# EAGLE design board_v1 (EAGLE 9.4.0)
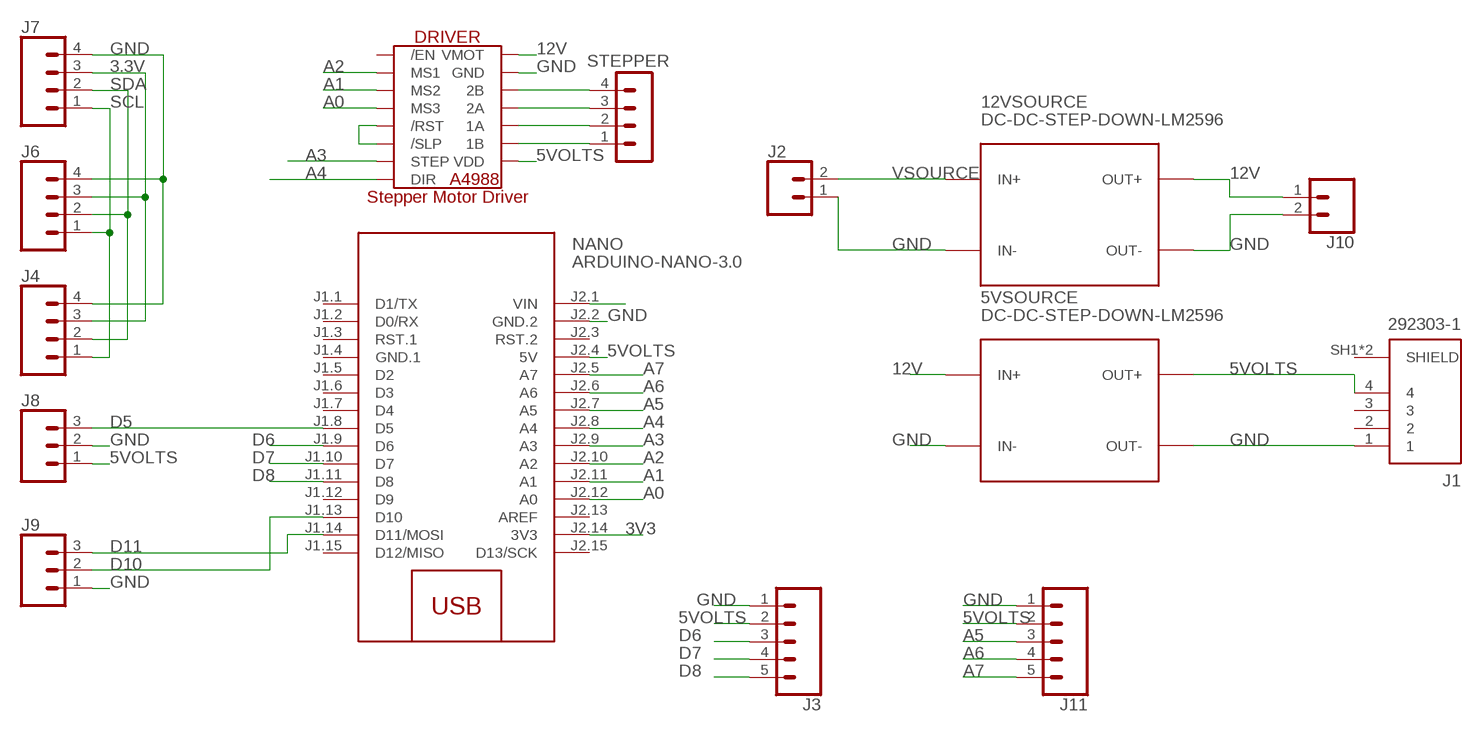
[diagram p0: schematic, sheet 1]

## Parts
5VSOURCE  DC-DC-STEP-DOWN-LM2596  [DC-DC-STEP-DOWN-LM2596]
12VSOURCE  DC-DC-STEP-DOWN-LM2596  [DC-DC-STEP-DOWN-LM2596]
DRIVER  A4988_STEP  [A4988_STEP]
J1  292303-1  [292303-1]
J2  CONN_025MM  [SCREWTERMINAL-5MM-2]
J3  CONN_05  [1X05]
J4  CONN_04POLAR  [MOLEX-1X4]
J6  CONN_04POLAR  [MOLEX-1X4]
J7  CONN_04POLAR  [MOLEX-1X4]
J8  CONN_03POLAR  [MOLEX-1X3]
J9  CONN_03POLAR  [MOLEX-1X3]
J10  CONN_025MM  [SCREWTERMINAL-5MM-2]
J11  CONN_05  [1X05]
NANO  ARDUINO-NANO-3.0  [ARDUINO-NANO-3.0]
STEPPER  MA04-1  [MA04-1]

## Nets
3.3V: J4.3 J6.3 J7.3
3V3: NANO.J2.14(3V3)
5VOLTS: 5VSOURCE.OUT+ DRIVER.VDD J1.4 J3.2 J8.1 J11.2 NANO.J2.4(5V)
12V: 5VSOURCE.IN+ 12VSOURCE.OUT+ DRIVER.VMOT J10.1
A0: DRIVER.MS3 NANO.J2.12(A0)
A1: DRIVER.MS2 NANO.J2.11(A1)
A2: DRIVER.MS1 NANO.J2.10(A2)
A3: DRIVER.STEP NANO.J2.9(A3)
A4: DRIVER.DIR NANO.J2.8(A4)
A5: J11.3 NANO.J2.7(A5)
A6: J11.4 NANO.J2.6(A6)
A7: J11.5 NANO.J2.5(A7)
D5: J8.3 NANO.J1.8(D5)
D6: J3.3 NANO.J1.9(D6)
D7: J3.4 NANO.J1.10(D7)
D8: J3.5 NANO.J1.11(D8)
D10: J9.2 NANO.J1.13(D10)
D11: J9.3 NANO.J1.14(D11/MOSI)
GND: 5VSOURCE.IN- 5VSOURCE.OUT- 12VSOURCE.IN- 12VSOURCE.OUT- DRIVER.GND DRIVER.GND2(GND) J1.1 J2.1 J3.1 J4.4 J6.4 J7.4 J8.2 J9.1 J10.2 J11.1 NANO.J2.2(GND.2)
N$1: NANO.J2.1(VIN)
N$2: DRIVER.2B STEPPER.4
N$6: DRIVER.2A STEPPER.3
N$7: DRIVER.1A STEPPER.2
N$8: DRIVER.1B STEPPER.1
N$10: DRIVER./RST DRIVER./SLP
SCL: J4.1 J6.1 J7.1
SDA: J4.2 J6.2 J7.2
VSOURCE: 12VSOURCE.IN+ J2.2
Unconnected: DRIVER./EN J1.2 J1.3 NANO.J1.1(D1/TX) NANO.J1.2(D0/RX) NANO.J1.3(RST.1) NANO.J1.5(D2) NANO.J1.6(D3) NANO.J1.7(D4) NANO.J1.12(D9) NANO.J1.15(D12/MISO) NANO.J2.3(RST.2) NANO.J2.13(AREF) NANO.J2.15(D13/SCK)

## Power pins joined to a net without a drawn wire
GND.1: NANO.J1.4(GND.1)
SHIELD: J1.SH1(SHIELD) J1.SH2(SHIELD)

## Library data of the parts
5VSOURCE 12VSOURCE = diy-modules:DC-DC-STEP-DOWN-LM2596: DC/DC Step-Down Regulator based on LM2596-ADJ chip LM2596 datasheet available here: http://www.ti.com/lit/ds/symlink/lm2596.pdf Click here to find device on ebay.com <http://www.ebay.com/sch/lm2596+power+regulator>
DRIVER = IC:A4988_STEP
J1 = USB connector:292303-1: CONN RCPT USB2.0 TYPEA 4POS R/A Manufacturer's datasheet <https://www.te.com/commerce/DocumentDelivery/DDEController?Action=srchrtrv&DocNm=292303&DocType=Customer+Drawing&DocLang=English>; CREATED_BY: PCBLayout.com; DIGIKEY_PARTNO: A31726-ND; MANUFACTURER: TE Connectivity AMP Connectors; MPN: 292303-1
J2 J10 = SparkFun-Connectors:CONN_02: Multi connection point. Often used as Generic Header-pin footprint for 0.1 inch spaced/style header connections On any of the 0.1 inch spaced packages, you can populate with these: Break Away Headers - Straight <https://www.sparkfun.com/products/116> (PRT-00116) Break Away Male Headers - Right Angle <https://www.sparkfun.com/products/553> (PRT-00553) Female Headers <https://www.sparkfun.com/products/115> (PRT-00115) Break Away Headers - Machine Pin <https://www.sparkfun.com/products/117> (PRT-00117) Break Away Female Headers - Swiss Machine Pin <https://www.sparkfun.com/products/743> (PRT-00743) For SCREWTERMINALS and SPRING TERMINALS visit here: Screw Terimnals on SparkFun.com <https://www.sparkfun.com/search/results?term=Screw+Terminals> (5mm/3.5mm/2.54mm spacing) This device is also useful as a general connection point to wire up your design to another part of your project. Our various solder wires solder well into these plated through hole pads. Hook-Up Wire - Assortment (Stranded, 22 AWG) <https://www.sparkfun.com/products/11375> (PRT-11375) Hook-Up Wire - Assortment (Solid Core, 22 AWG) <https://www.sparkfun.com/products/11367> (PRT-11367) View the entire wire category on our website here <https://www.sparkfun.com/categories/141> Special notes: Molex polarized connector foot print use with: PRT-08233 with associated crimp pins and housings. 2.54_SCREWTERM for use with PRT-10571. 3.5mm Screw Terminal footprints for PRT-08084 5mm Screw Terminal footprints for use with PRT-08432; SF_SKU: PRT-08432
J3 J11 = SparkFun-Connectors:CONN_05: Multi connection point. Often used as Generic Header-pin footprint for 0.1 inch spaced/style header connections On any of the 0.1 inch spaced packages, you can populate with these: Break Away Headers - Straight <https://www.sparkfun.com/products/116> (PRT-00116) Break Away Male Headers - Right Angle <https://www.sparkfun.com/products/553> (PRT-00553) Female Headers <https://www.sparkfun.com/products/115> (PRT-00115) Break Away Headers - Machine Pin <https://www.sparkfun.com/products/117> (PRT-00117) Break Away Female Headers - Swiss Machine Pin <https://www.sparkfun.com/products/743> (PRT-00743) For SCREWTERMINALS and SPRING TERMINALS visit here: Screw Terimnals on SparkFun.com <https://www.sparkfun.com/search/results?term=Screw+Terminals> (5mm/3.5mm/2.54mm spacing) This device is also useful as a general connection point to wire up your design to another part of your project. Our various solder wires solder well into these plated through hole pads. Hook-Up Wire - Assortment (Stranded, 22 AWG) <https://www.sparkfun.com/products/11375> (PRT-11375) Hook-Up Wire - Assortment (Solid Core, 22 AWG) <https://www.sparkfun.com/products/11367> (PRT-11367) View the entire wire category on our website here <https://www.sparkfun.com/categories/141> Special notes: Molex polarized connector foot print use with SKU : PRT-08231 with associated crimp pins and housings. 1MM SMD Version SKU: PRT-10208
J4 J6 J7 = SparkFun-Connectors:CONN_04: Multi connection point. Often used as Generic Header-pin footprint for 0.1 inch spaced/style header connections On any of the 0.1 inch spaced packages, you can populate with these: Break Away Headers - Straight <https://www.sparkfun.com/products/116> (PRT-00116) Break Away Male Headers - Right Angle <https://www.sparkfun.com/products/553> (PRT-00553) Female Headers <https://www.sparkfun.com/products/115> (PRT-00115) Break Away Headers - Machine Pin <https://www.sparkfun.com/products/117> (PRT-00117) Break Away Female Headers - Swiss Machine Pin <https://www.sparkfun.com/products/743> (PRT-00743) For SCREWTERMINALS and SPRING TERMINALS visit here: Screw Terimnals on SparkFun.com <https://www.sparkfun.com/search/results?term=Screw+Terminals> (5mm/3.5mm/2.54mm spacing) This device is also useful as a general connection point to wire up your design to another part of your project. Our various solder wires solder well into these plated through hole pads. Hook-Up Wire - Assortment (Stranded, 22 AWG) <https://www.sparkfun.com/products/11375> (PRT-11375) Hook-Up Wire - Assortment (Solid Core, 22 AWG) <https://www.sparkfun.com/products/11367> (PRT-11367) View the entire wire category on our website here <https://www.sparkfun.com/categories/141> Special notes: Molex polarized connector foot print use with SKU : PRT-08231 with associated crimp pins and housings. 1MM SMD Version SKU: PRT-10208; PROD_ID: CONN-08186; SF_ID: PRT-08231
J8 J9 = SparkFun-Connectors:CONN_03: Multi connection point. Often used as Generic Header-pin footprint for 0.1 inch spaced/style header connections On any of the 0.1 inch spaced packages, you can populate with these: Break Away Headers - Straight <https://www.sparkfun.com/products/116> (PRT-00116) Break Away Male Headers - Right Angle <https://www.sparkfun.com/products/553> (PRT-00553) Female Headers <https://www.sparkfun.com/products/115> (PRT-00115) Break Away Headers - Machine Pin <https://www.sparkfun.com/products/117> (PRT-00117) Break Away Female Headers - Swiss Machine Pin <https://www.sparkfun.com/products/743> (PRT-00743) Stackable Header - 3 Pin (Female, 0.1") <https://www.sparkfun.com/products/13875> (PRT-13875) For SCREWTERMINALS and SPRING TERMINALS visit here: Screw Terimnals on SparkFun.com <https://www.sparkfun.com/search/results?term=Screw+Terminals> (5mm/3.5mm/2.54mm spacing) This device is also useful as a general connection point to wire up your design to another part of your project. Our various solder wires solder well into these plated through hole pads. Hook-Up Wire - Assortment (Stranded, 22 AWG) <https://www.sparkfun.com/products/11375> (PRT-11375) Hook-Up Wire - Assortment (Solid Core, 22 AWG) <https://www.sparkfun.com/products/11367> (PRT-11367) View the entire wire category on our website here <https://www.sparkfun.com/categories/141> Special notes: Molex polarized connector foot print use with SKU : PRT-08232 with associated crimp pins and housings.; PROD_ID: CONN-08625; SF_ID: PRT-08096
NANO = diy-modules:ARDUINO-NANO-3.0: Arduino Nano 3.0 and compatible devices More details available here: https://www.arduino.cc/en/Main/ArduinoBoardNano Click here to find device on ebay.com <http://www.ebay.com/sch/arduino+nano>
STEPPER = con-lstb:MA04-1: PIN HEADER; OC_FARNELL: unknown; OC_NEWARK: unknown

## Board
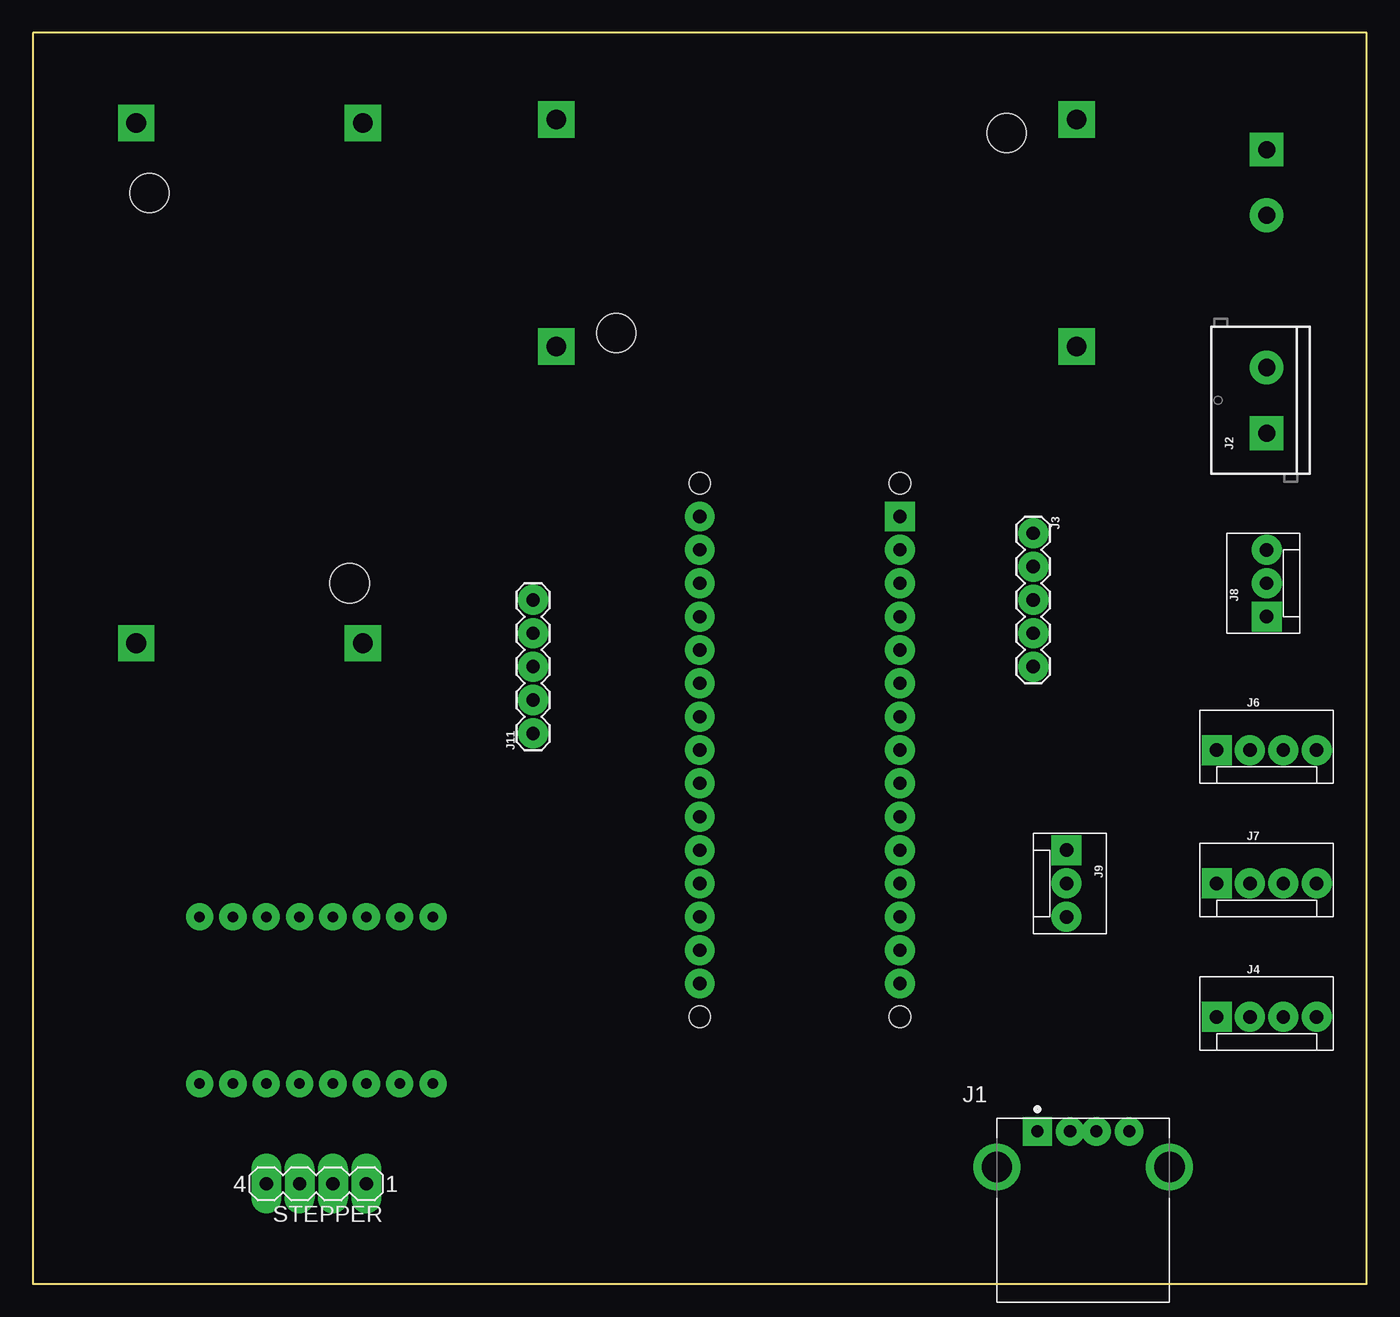
[diagram p1: board, top side]
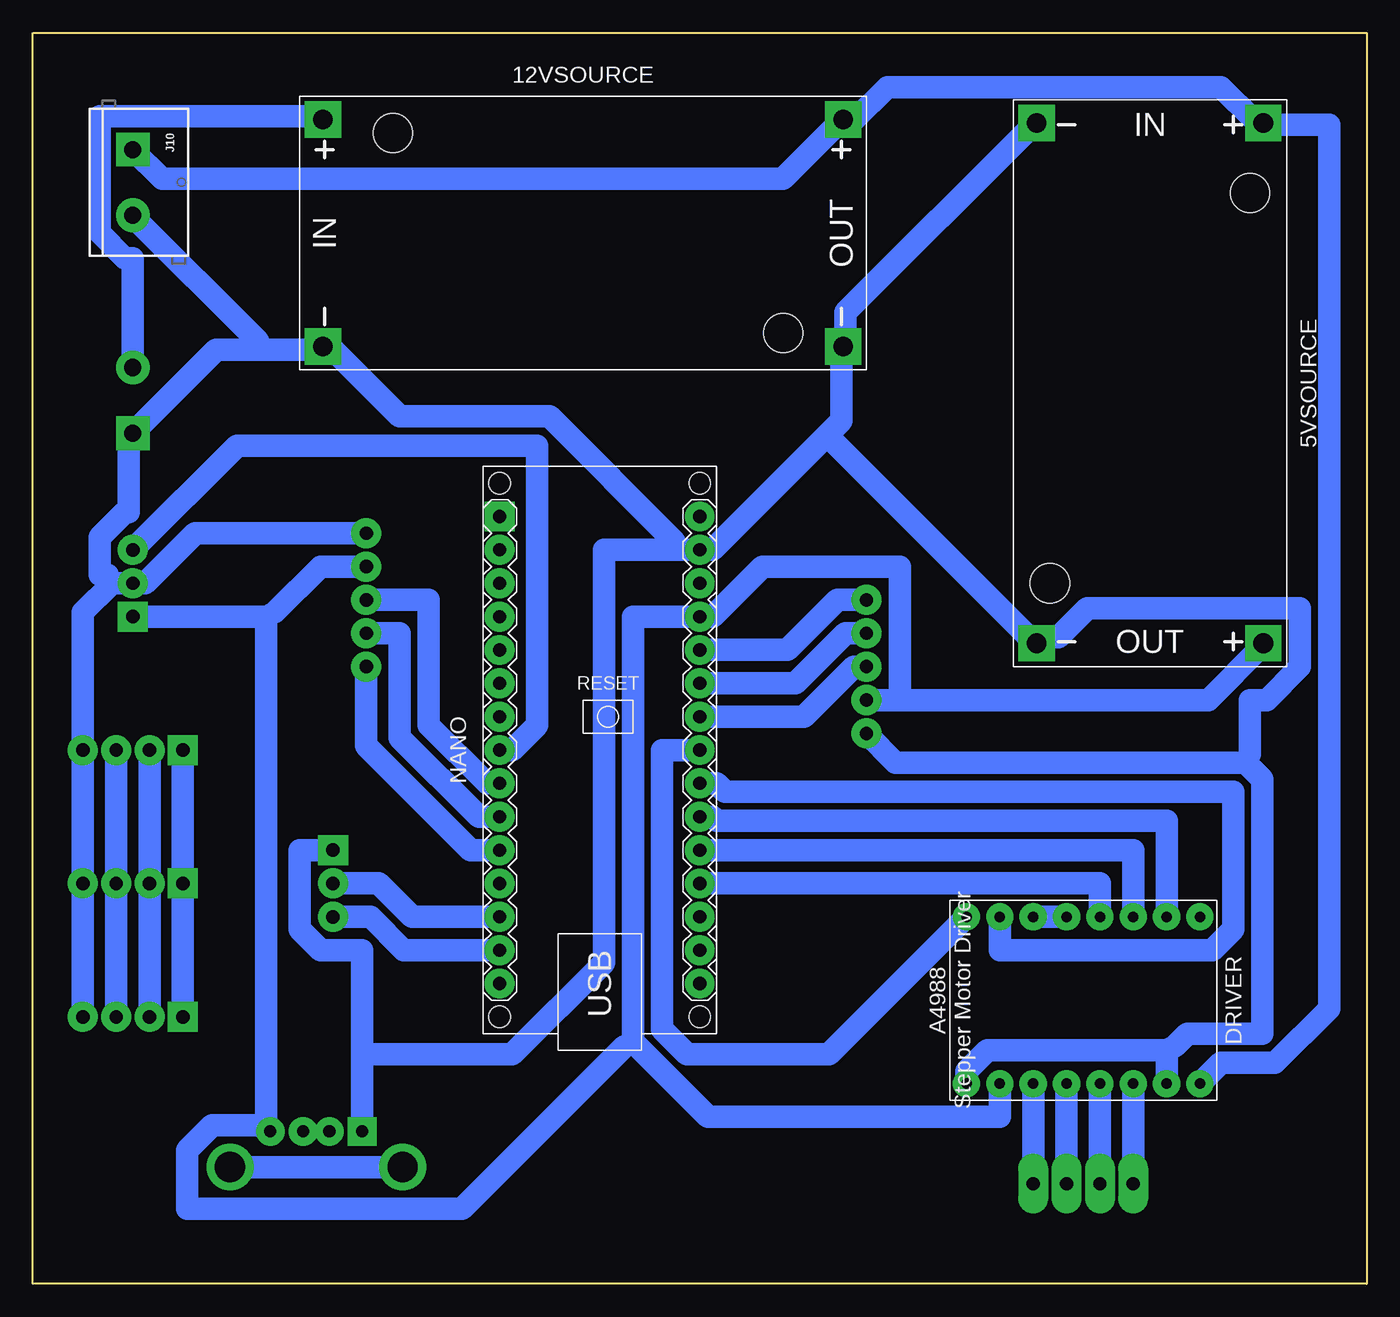
[diagram p2: board, bottom side, seen from below]

Size 101.6 x 95.25 mm. Coordinates in mm from the lower left corner, seen from the top.
Outline: 0,95.25 0,0 101.6,0 101.6,95.25 0,95.25
Copper layers (1*16): Top 0.035mm / dielectric 1.5mm / Bottom 0.035mm
Design rules "default *": minimum track width 1.7mm, minimum drill 0.8mm, track to track 0.4mm, track to pad 0.4mm, pad to pad 0.4mm, via to via 0.4mm, smd to smd 6mil, copper to edge 40mil, drill to drill 6mil, minimum pad ring 25mil, minimum via ring 8mil, stop-mask expansion 4mil, vias tented up to drill 0mil, thermal gap 10mil
tRestrict: area -3.8,-5.1 to 102.9,104.1

### Footprints (pad centres in the part's own frame; a part is rotated, then mirrored left to right if it is on the bottom)
DC-DC-STEP-DOWN-LM2596 = drill 1.5 pad 2.5 square: IN+ -19.812,8.636; IN- -19.812,-8.636; OUT+ 19.812,8.636; OUT- 19.812,-8.636 | hole 3: -14.478,7.62; 15.24,-7.62
A4988_STEP = drill 0.8 pad 1.905: 1A 6.35,-1.27; 1B 6.35,-3.81; 2A 6.35,1.27; 2B 6.35,3.81; /EN -6.35,8.89; /RST -6.35,-1.27; /SLP -6.35,-3.81; DIR -6.35,-8.89; GND 6.35,6.35; GND2 6.35,-8.89; MS1 -6.35,6.35; MS2 -6.35,3.81; MS3 -6.35,1.27; STEP -6.35,-6.35; VDD 6.35,-6.35; VMOT 6.35,8.89
292303-1 = drill 0.92 square: 1 -3.5,2.71 | drill 0.92: 2 -1,2.71; 3 1,2.71; 4 3.5,2.71 | drill 2.3: SH1 -6.57,0; SH2 6.57,0
SCREWTERMINAL-5MM-2 = drill 1.3 pad 2.032 square: 1 0,0 | drill 1.3 pad 2.032: 2 5,0
1X05 = drill 1.016 pad 1.88: 1 0,0; 2 2.54,0; 3 5.08,0; 4 7.62,0; 5 10.16,0
MOLEX-1X4 = drill 1.016 pad 1.88 square: 1 0,0 | drill 1.016 pad 1.88: 2 2.54,0; 3 5.08,0; 4 7.62,0
MOLEX-1X3 = drill 1.016 pad 1.88 square: 1 0,0 | drill 1.016 pad 1.88: 2 2.54,0; 3 5.08,0
ARDUINO-NANO-3.0 = drill 1 square: J1.1 17.78,7.62 | drill 1: J1.2 15.24,7.62; J1.3 12.7,7.62; J1.4 10.16,7.62; J1.5 7.62,7.62; J1.6 5.08,7.62; J1.7 2.54,7.62; J1.8 0,7.62; J1.9 -2.54,7.62; J1.10 -5.08,7.62; J1.11 -7.62,7.62; J1.12 -10.16,7.62; J1.13 -12.7,7.62; J1.14 -15.24,7.62; J1.15 -17.78,7.62; J2.1 17.78,-7.62; J2.2 15.24,-7.62; J2.3 12.7,-7.62; J2.4 10.16,-7.62; J2.5 7.62,-7.62; J2.6 5.08,-7.62; J2.7 2.54,-7.62; J2.8 0,-7.62; J2.9 -2.54,-7.62; J2.10 -5.08,-7.62; J2.11 -7.62,-7.62; J2.12 -10.16,-7.62; J2.13 -12.7,-7.62; J2.14 -15.24,-7.62; J2.15 -17.78,-7.62 | hole 1.651: -20.32,7.62; -20.32,-7.62; 20.32,-7.62; 20.32,7.62
MA04-1 = drill 1.016 long: 1 -3.81,0; 2 -1.27,0; 3 1.27,0; 4 3.81,0

### Placement (x,y rotation side)
5VSOURCE  16.51,68.58 270 bottom
12VSOURCE  59.69,80.01 0 bottom
DRIVER  21.59,21.59 270 bottom
J1  80.01,8.89 0 top
J2  93.98,64.77 90 top
J3  76.2,57.15 270 top
J4  90.17,20.32 0 top
J6  90.17,40.64 0 top
J7  90.17,30.48 0 top
J8  93.98,50.8 90 top
J9  78.74,33.02 270 top
J10  93.98,86.36 270 bottom
J11  38.1,41.91 90 top
NANO  58.42,40.64 90 bottom
STEPPER  21.59,7.62 180 top

### Tracks (layer width: path | path; a pad name or v marks a point on that pad's centre or on a via)
3.3V
  Bottom 1.7: J4.3 J7.3 J6.3
5VOLTS
  Bottom 1.7: 83.82,50.8 83.82,11.75 J1.4 84.46,12.06 87.95,12.06 89.85,10.16 89.85,5.72 68.9,5.72 56.51,18.1 55.88,18.41 | J8.1 83.82,50.8 | J3.2 79.69,54.61 83.19,51.12 83.82,50.8 | 35.56,44.45 12.06,44.45 7.94,48.58 5VSOURCE.OUT+ | 35.56,44.45 J11.2 | DRIVER.VDD 27.94,12.7 50.16,12.7 55.88,18.41 | 55.88,18.41 55.88,50.8 NANO.J2.4 49.85,50.8 46.04,54.61 35.56,54.61 35.56,44.45
12V
  Bottom 1.7: J10.1 91.76,84.14 44.45,84.14 40.01,88.58 12VSOURCE.OUT+ 39.05,88.58 36.51,91.12 11.11,91.12 8.57,88.58 5VSOURCE.IN+ 7.62,88.27 2.86,88.27 2.86,20.95 6.98,16.83 11.11,16.83 DRIVER.VMOT
A0
  Bottom 1.7: DRIVER.MS3 20.32,30.48 NANO.J2.12
A1
  Bottom 1.7: DRIVER.MS2 17.78,33.02 NANO.J2.11
A2
  Bottom 1.7: DRIVER.MS1 15.24,35.24 49.53,35.24 49.85,35.56 NANO.J2.10
A3
  Bottom 1.7: DRIVER.STEP 27.94,25.4 11.75,25.4 10.16,26.99 10.16,37.46 48.9,37.46 49.53,38.1 NANO.J2.9
A4
  Bottom 1.7: DRIVER.DIR 40.96,17.46 51.75,17.46 53.66,19.37 53.66,40.64 NANO.J2.8
A5
  Bottom 1.7: NANO.J2.7 42.86,43.18 39.05,46.99 J11.3
A6
  Bottom 1.7: NANO.J2.6 43.5,45.72 39.69,49.53 J11.4
A7
  Bottom 1.7: NANO.J2.5 44.13,48.26 40.32,52.07 J11.5
D5
  Bottom 1.7: NANO.J1.8 65.09,40.64 63.18,42.55 63.18,63.82 86.04,63.82 J8.3
D6
  Bottom 1.7: NANO.J1.9 66.99,38.1 71.44,42.55 71.44,52.07 J3.3
D7
  Bottom 1.7: NANO.J1.10 67.63,35.56 73.66,41.59 73.66,49.53 J3.4
D8
  Bottom 1.7: NANO.J1.11 68.26,33.02 76.2,40.96 J3.5
D10
  Bottom 1.7: NANO.J1.13 72.71,27.94 75.25,30.48 J9.2
D11
  Bottom 1.7: NANO.J1.14 73.34,25.4 75.88,27.94 J9.3
GND
  Bottom 1.7: 84.46,71.12 79.69,71.12 12VSOURCE.IN- 78.74,71.12 73.66,66.04 62.23,66.04 52.71,56.52 52.71,55.88 | 84.46,71.12 87.63,71.12 J2.1 94.3,64.13 94.3,58.74 94.62,58.74 96.52,56.83 96.52,53.97 95.88,53.97 95.57,53.34 | J10.2 93.98,81.28 84.46,71.75 84.46,71.12 | J4.4 J7.4 J6.4 97.79,51.12 95.57,53.34 | 95.57,53.34 J8.2 93.03,53.34 89.22,57.15 J3.1 | 15.24,17.78 DRIVER.GND | 15.24,17.78 28.89,17.78 30.48,16.19 DRIVER.GND2 | J11.1 35.88,39.69 9.21,39.69 | 9.21,39.69 7.94,38.42 7.94,19.05 13.65,19.05 14.6,18.1 15.24,17.78 | 76.52,17.46 76.52,25.4 79.69,25.4 81.28,26.99 81.28,33.02 J9.1 | 76.52,17.46 76.52,11.75 J1.1 | 41.12,64.61 40.01,65.72 40.01,71.12 12VSOURCE.OUT- 39.69,72.07 39.69,73.98 25.4,88.27 5VSOURCE.IN- | 41.12,64.61 49.85,55.88 NANO.J2.2 52.71,55.88 | 41.12,64.61 25.4,48.89 5VSOURCE.OUT- 24.45,49.21 23.49,49.21 21.27,51.44 5.08,51.44 5.08,46.99 7.62,44.45 8.89,44.45 8.89,40.32 9.21,39.69 | 76.52,17.46 65.09,17.46 58.1,24.45 58.1,55.88 52.71,55.88
N$2
  Bottom 1.7: STEPPER.4 DRIVER.2B
N$6
  Bottom 1.7: STEPPER.3 DRIVER.2A
N$7
  Bottom 1.7: STEPPER.2 DRIVER.1A
N$8
  Bottom 1.7: STEPPER.1 DRIVER.1B
N$10
  Bottom 1.7: DRIVER./SLP DRIVER./RST
SCL
  Bottom 1.7: J4.1 J7.1 J6.1
SDA
  Bottom 1.7: J4.2 J7.2 J6.2
SHIELD
  Bottom 1.7: J1.SH2 J1.SH1
VSOURCE
  Bottom 1.7: J2.2 93.98,78.11 94.62,78.11 96.52,80.01 96.52,88.9 79.69,88.9 12VSOURCE.IN+